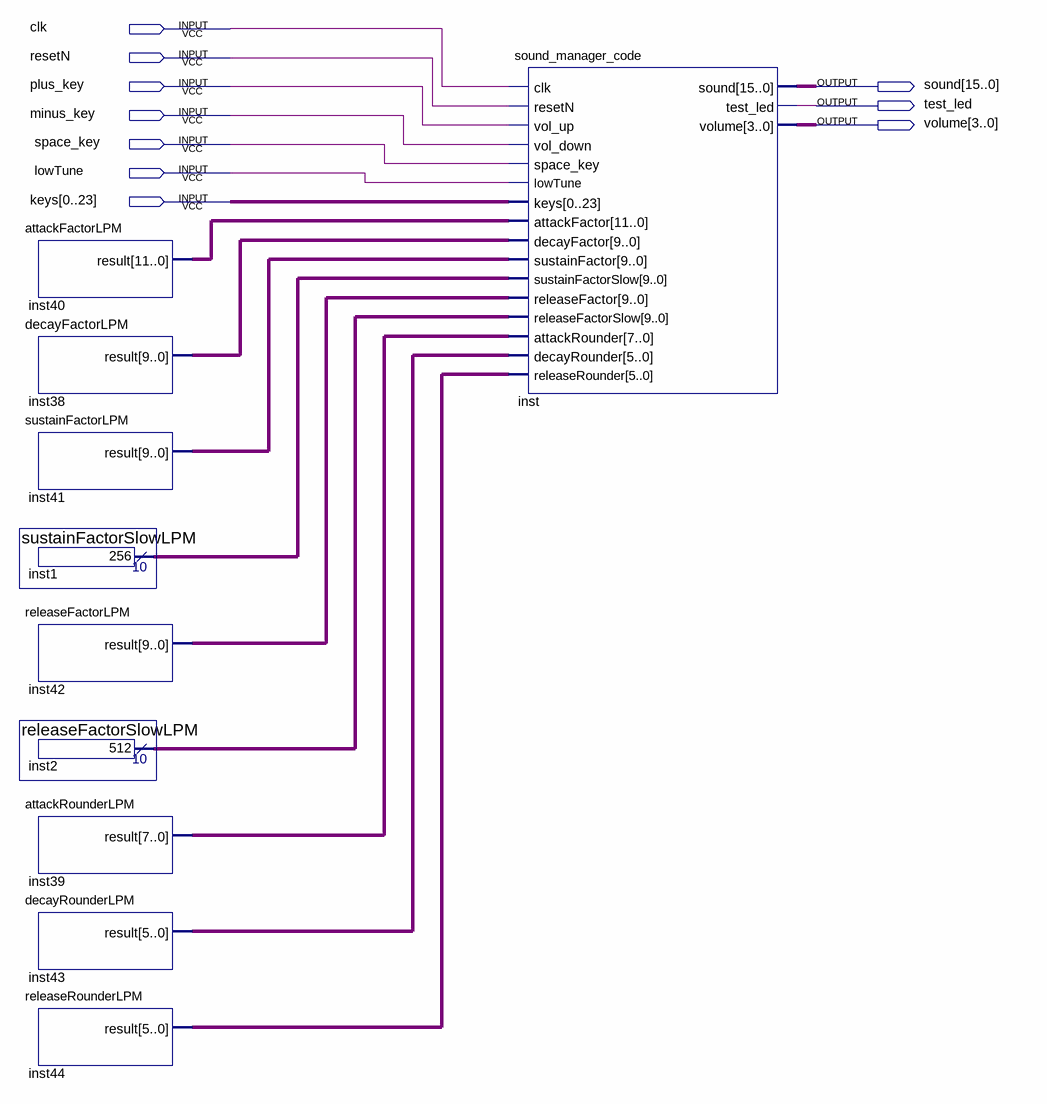
[diagram p0: schematic sheet]
// Quartus schematic sound_manager.bdf as structural Verilog: 10 symbols, 10 pins
module sound_manager (
  input  clk,
  input  resetN,
  input  plus_key,
  input  minus_key,
  input  space_key,
  input  lowTune,
  input  [0:23] keys,
  output [15:0] sound,
  output test_led,
  output [3:0] volume
);

  wire [5:0] inst43_result, inst44_result;
  wire [7:0] inst39_result;
  wire [9:0] inst1_result, inst2_result, inst38_result, inst41_result, inst42_result;
  wire [11:0] inst40_result;

  attackFactorLPM inst40 (.result(inst40_result));
  decayFactorLPM inst38 (.result(inst38_result));
  sustainFactorLPM inst41 (.result(inst41_result));
  sustainFactorSlowLPM inst1 (.result(inst1_result));
  releaseFactorLPM inst42 (.result(inst42_result));
  releaseFactorSlowLPM inst2 (.result(inst2_result));
  attackRounderLPM inst39 (.result(inst39_result));
  decayRounderLPM inst43 (.result(inst43_result));
  releaseRounderLPM inst44 (.result(inst44_result));
  sound_manager_code inst (
    .clk(clk), .resetN(resetN), .vol_up(plus_key), .vol_down(minus_key), .space_key(space_key),
    .lowTune(lowTune), .keys(keys), .attackFactor(inst40_result), .decayFactor(inst38_result),
    .sustainFactor(inst41_result), .sustainFactorSlow(inst1_result), .releaseFactor(inst42_result),
    .releaseFactorSlow(inst2_result), .attackRounder(inst39_result), .decayRounder(inst43_result),
    .releaseRounder(inst44_result), .sound(sound), .test_led(test_led), .volume(volume));
endmodule
